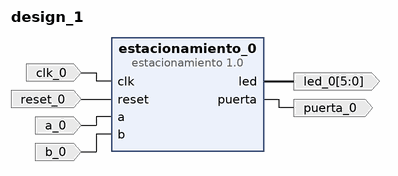
[diagram p0: block diagram of the top level]
# Vivado block design design_1, xc7a35tcpg236-1, Vivado 2018.3
create_bd_design design_1

create_bd_port -dir I -type clk clk_0
create_bd_port -dir I -type rst reset_0
create_bd_port -dir I a_0
create_bd_port -dir I b_0
create_bd_port -dir O puerta_0
create_bd_port -dir O -from 5 -to 0 led_0

create_bd_cell -type ip -vlnv xilinx.com:user:estacionamiento:1.0 estacionamiento_0

# ---- connections ----

connect_bd_net -net clk_0_1 [get_bd_ports clk_0] [get_bd_pins estacionamiento_0/clk]
connect_bd_net -net reset_0_1 [get_bd_ports reset_0] [get_bd_pins estacionamiento_0/reset]
connect_bd_net -net a_0_1 [get_bd_ports a_0] [get_bd_pins estacionamiento_0/a]
connect_bd_net -net b_0_1 [get_bd_ports b_0] [get_bd_pins estacionamiento_0/b]
connect_bd_net [get_bd_pins estacionamiento_0/puerta] [get_bd_ports puerta_0]
connect_bd_net [get_bd_pins estacionamiento_0/led] [get_bd_ports led_0]

validate_bd_design
save_bd_design
